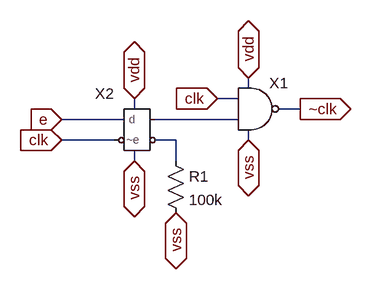
[diagram p0: schematic clock_gate.asc]
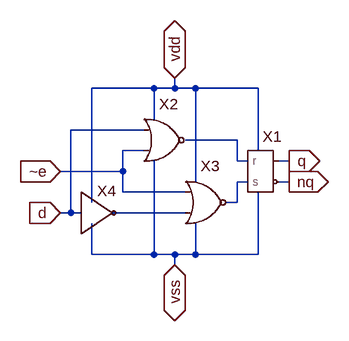
[diagram p1: sub-circuit d_latch.asc]
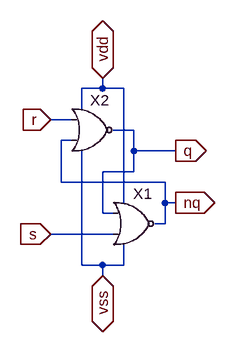
[diagram p2: sub-circuit sr_latch.asc]
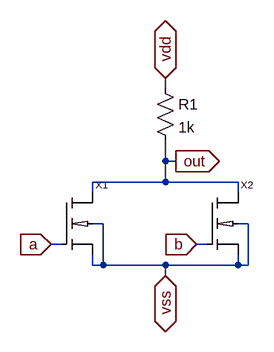
[diagram p3: sub-circuit nor.asc]
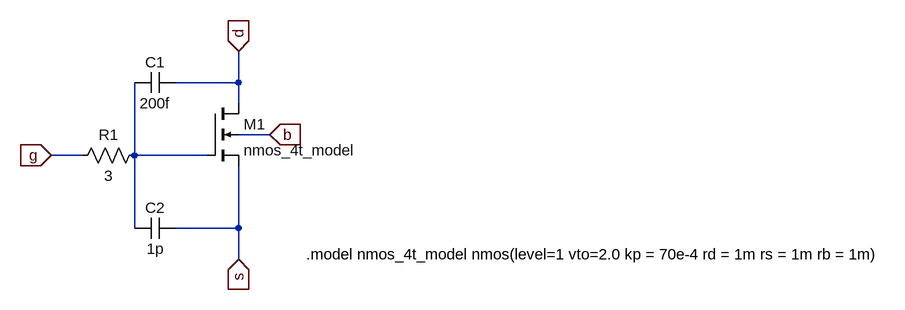
[diagram p4: sub-circuit nmos_4t.asc]
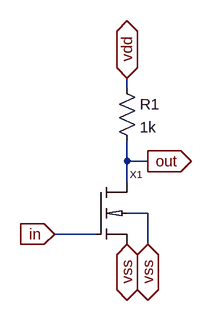
[diagram p5: sub-circuit not.asc]
clock_gate.asc, the LTspice schematic file:
Version 4
SHEET 1 880 680
WIRE 336 112 336 96
WIRE 320 128 288 128
WIRE 160 144 160 128
WIRE 416 144 384 144
WIRE 144 160 48 160
WIRE 320 160 192 160
WIRE 128 192 48 192
WIRE 224 192 192 192
WIRE 336 192 336 176
WIRE 160 224 160 208
WIRE 224 224 224 192
FLAG 48 160 e
IOPIN 48 160 In
FLAG 48 192 clk
IOPIN 48 192 In
FLAG 288 128 clk
IOPIN 288 128 In
FLAG 160 224 vss
IOPIN 160 224 BiDir
FLAG 160 128 vdd
IOPIN 160 128 BiDir
FLAG 336 192 vss
IOPIN 336 192 BiDir
FLAG 336 96 vdd
IOPIN 336 96 BiDir
FLAG 224 304 vss
IOPIN 224 304 BiDir
FLAG 416 144 ~clk
IOPIN 416 144 Out
SYMBOL res 208 208 R0
SYMATTR InstName R1
SYMATTR Value 100k
SYMBOL d_latch 160 176 R0
WINDOW 0 -46 -40 Bottom 2
SYMATTR InstName X2
SYMBOL nand 352 80 R0
SYMATTR InstName X1

d_latch.asc, the sub-circuit schematic file:
Version 4
SHEET 1 880 680
WIRE -16 0 -112 0
WIRE 16 0 16 -16
WIRE 16 0 -16 0
WIRE 48 0 16 0
WIRE 144 0 48 0
WIRE -16 48 -16 0
WIRE -32 64 -144 64
WIRE 112 80 32 80
WIRE -32 96 -64 96
WIRE 144 96 144 0
WIRE 112 112 112 80
WIRE 128 112 112 112
WIRE 192 112 176 112
WIRE -64 128 -64 96
WIRE -64 128 -160 128
WIRE 48 144 48 0
WIRE 128 144 112 144
WIRE 192 144 176 144
WIRE -64 160 -64 128
WIRE 32 160 -64 160
WIRE -112 176 -112 0
WIRE 112 176 112 144
WIRE 112 176 96 176
WIRE -144 192 -144 64
WIRE -144 192 -160 192
WIRE -128 192 -144 192
WIRE 32 192 -80 192
WIRE -112 256 -112 208
WIRE -16 256 -16 112
WIRE -16 256 -112 256
WIRE 16 256 -16 256
WIRE 48 256 48 208
WIRE 48 256 16 256
WIRE 144 256 144 160
WIRE 144 256 48 256
WIRE 16 272 16 256
FLAG 16 272 vss
IOPIN 16 272 BiDir
FLAG 16 -16 vdd
IOPIN 16 -16 BiDir
FLAG 192 112 q
IOPIN 192 112 Out
FLAG 192 144 nq
IOPIN 192 144 Out
FLAG -160 192 d
IOPIN -160 192 In
FLAG -160 128 ~e
IOPIN -160 128 In
SYMBOL sr_latch 160 128 R0
WINDOW 0 6 -38 Bottom 2
SYMATTR InstName X1
SYMBOL not -128 192 R0
WINDOW 0 39 -18 Bottom 2
SYMATTR InstName X4
SYMBOL nor 0 16 R0
SYMATTR InstName X2
SYMBOL nor 64 112 R0
SYMATTR InstName X3

sr_latch.asc, the sub-circuit schematic file:
Version 4
SHEET 1 880 680
WIRE 208 0 208 -16
WIRE 208 0 176 0
WIRE 240 0 208 0
WIRE 176 32 176 0
WIRE 160 48 128 48
WIRE 256 64 224 64
WIRE 160 80 144 80
WIRE 256 96 256 64
WIRE 320 96 256 96
WIRE 256 128 256 96
WIRE 256 128 208 128
WIRE 144 144 144 80
WIRE 304 144 144 144
WIRE 240 176 240 0
WIRE 304 176 304 144
WIRE 320 176 304 176
WIRE 208 192 208 128
WIRE 224 192 208 192
WIRE 304 208 304 176
WIRE 304 208 288 208
WIRE 224 224 128 224
WIRE 176 272 176 96
WIRE 208 272 176 272
WIRE 240 272 240 240
WIRE 240 272 208 272
WIRE 208 288 208 272
FLAG 128 224 s
IOPIN 128 224 In
FLAG 128 48 r
IOPIN 128 48 In
FLAG 320 96 q
IOPIN 320 96 Out
FLAG 320 176 nq
IOPIN 320 176 Out
FLAG 208 288 vss
IOPIN 208 288 BiDir
FLAG 208 -16 vdd
IOPIN 208 -16 BiDir
SYMBOL nor 256 144 R0
WINDOW 0 -1 18 Left 2
SYMATTR InstName X1
SYMBOL nor 192 0 R0
WINDOW 0 -3 18 Left 2
SYMATTR InstName X2

nor.asc, the sub-circuit schematic file:
Version 4
SHEET 1 880 680
WIRE 240 48 240 32
WIRE 240 160 240 128
WIRE 256 160 240 160
WIRE 240 192 240 160
WIRE 240 192 128 192
WIRE 352 192 240 192
WIRE 128 208 128 192
WIRE 352 208 352 192
WIRE 144 256 128 256
WIRE 368 256 352 256
WIRE 80 288 64 288
WIRE 304 288 288 288
WIRE 128 320 128 304
WIRE 144 320 144 256
WIRE 144 320 128 320
WIRE 240 320 144 320
WIRE 352 320 352 304
WIRE 352 320 240 320
WIRE 368 320 368 256
WIRE 368 320 352 320
WIRE 240 336 240 320
FLAG 240 32 vdd
IOPIN 240 32 BiDir
FLAG 240 336 vss
IOPIN 240 336 BiDir
FLAG 256 160 out
IOPIN 256 160 Out
FLAG 288 288 b
IOPIN 288 288 In
FLAG 64 288 a
IOPIN 64 288 In
SYMBOL res 224 32 R0
SYMATTR InstName R1
SYMATTR Value 1k
SYMBOL nmos_4t 80 208 R0
SYMATTR InstName X1
SYMBOL nmos_4t 304 208 R0
SYMATTR InstName X2

nmos_4t.asc, the sub-circuit schematic file:
Version 4
SHEET 1 880 680
WIRE -288 -224 -288 -272
WIRE -288 -224 -384 -224
WIRE -288 -192 -288 -224
WIRE -240 -144 -288 -144
WIRE -528 -112 -576 -112
WIRE -448 -112 -448 -224
WIRE -336 -112 -448 -112
WIRE -448 0 -448 -112
WIRE -288 0 -288 -96
WIRE -288 0 -384 0
WIRE -288 48 -288 0
FLAG -576 -112 g
IOPIN -576 -112 In
FLAG -288 -272 d
IOPIN -288 -272 In
FLAG -288 48 s
IOPIN -288 48 In
FLAG -240 -144 b
IOPIN -240 -144 In
SYMBOL nmos4 -336 -192 R0
SYMATTR InstName M1
SYMATTR Value nmos_4t_model
SYMBOL cap -384 -240 R90
WINDOW 0 0 32 VBottom 2
WINDOW 3 32 32 VTop 2
SYMATTR InstName C1
SYMATTR Value 200f
SYMBOL cap -384 -16 R90
WINDOW 0 0 32 VBottom 2
WINDOW 3 32 32 VTop 2
SYMATTR InstName C2
SYMATTR Value 1p
SYMBOL res -432 -128 R90
WINDOW 0 0 56 VBottom 2
WINDOW 3 32 56 VTop 2
SYMATTR InstName R1
SYMATTR Value 3
TEXT -184 40 Left 2 !.model nmos_4t_model nmos(level=1 vto=2.0 kp = 70e-4 rd = 1m rs = 1m rb = 1m)

not.asc, the sub-circuit schematic file:
Version 4
SHEET 1 880 680
WIRE 176 -96 176 -112
WIRE 176 16 176 -16
WIRE 208 16 176 16
WIRE 176 48 176 16
WIRE 208 96 176 96
WIRE 128 128 64 128
WIRE 208 144 208 96
FLAG 64 128 in
IOPIN 64 128 In
FLAG 176 144 vss
IOPIN 176 144 BiDir
FLAG 176 -112 vdd
IOPIN 176 -112 BiDir
FLAG 208 16 out
IOPIN 208 16 Out
FLAG 208 144 vss
IOPIN 208 144 BiDir
SYMBOL res 160 -112 R0
SYMATTR InstName R1
SYMATTR Value 1k
SYMBOL nmos_4t 128 48 R0
SYMATTR InstName X1

The netlist it stands for:
* clock_gate.asc
R1 N002 vss 100k
XX2 e clk N002 N001 vdd vss d_latch
XX1 clk N001 vdd vss ~clk nand  ; pins a b vdd vss out

* block symbol definitions
.subckt d_latch d ~e nq q vdd vss
XX1 N001 N002 nq q vdd vss sr_latch
XX4 d N003 vss vdd not
XX2 d ~e vdd vss N001 nor
XX3 ~e N003 vdd vss N002 nor
.ends d_latch

.subckt sr_latch r s nq q vdd vss
XX1 q s vdd vss nq nor
XX2 r nq vdd vss q nor
.ends sr_latch

.subckt nor a b vdd vss out
R1 vdd out 1k
XX1 out a vss vss nmos_4t
XX2 out b vss vss nmos_4t
.ends nor

.subckt nmos_4t D G S B
M1 d N001 s b nmos_4t_model
C1 d N001 200f
C2 s N001 1p
R1 N001 g 3
.model nmos_4t_model nmos(level=1 vto=2.0 kp = 70e-4 rd = 1m rs = 1m rb = 1m)
.ends nmos_4t

.subckt not in out vss vdd
R1 vdd out 1k
XX1 out in vss vss nmos_4t
.ends not

.model NMOS NMOS
.model PMOS PMOS
.lib standard.mos
.backanno
.end